# Altium project Newracom-WiWi.PrjPcb (part 1 of 3)
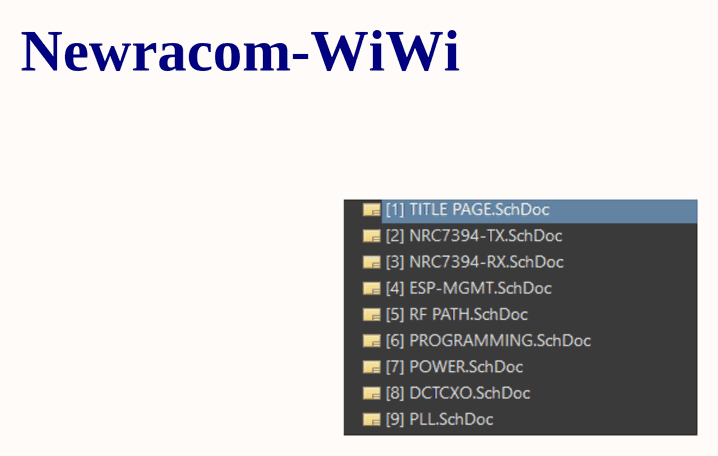
[diagram p0: TITLE PAGE.SchDoc]
DrawnBy: Armando Pinales; Revision: V1.1
8 sheets, 327 parts. Net scope: global (net labels, ports and power ports of the same name join across sheets).
Board file: Newracom_WIWi_V1.PcbDoc
Sheets:
  TITLE PAGE.SchDoc
  NRC7394-TX.SchDoc
  NRC7394-RX.SchDoc
  RF PATH.SchDoc
  PROGRAMMING.SchDoc
  POWER.SchDoc
  DCTCXO.SchDoc
  PLL.SchDoc

## Sheet TITLE PAGE.SchDoc: TITLE PAGE
size A; SheetNumber: 1; SheetTotal: 9

### Notes on the sheet
- Newracom-WiWi

## Sheet NRC7394-TX.SchDoc: ESP-TX
size C; SheetNumber: 2; SheetTotal: 9; SPICEModelCacheZYIMXMCN: <root> / <DocumentId>ZYIMXMCN</DocumentId> / </root>
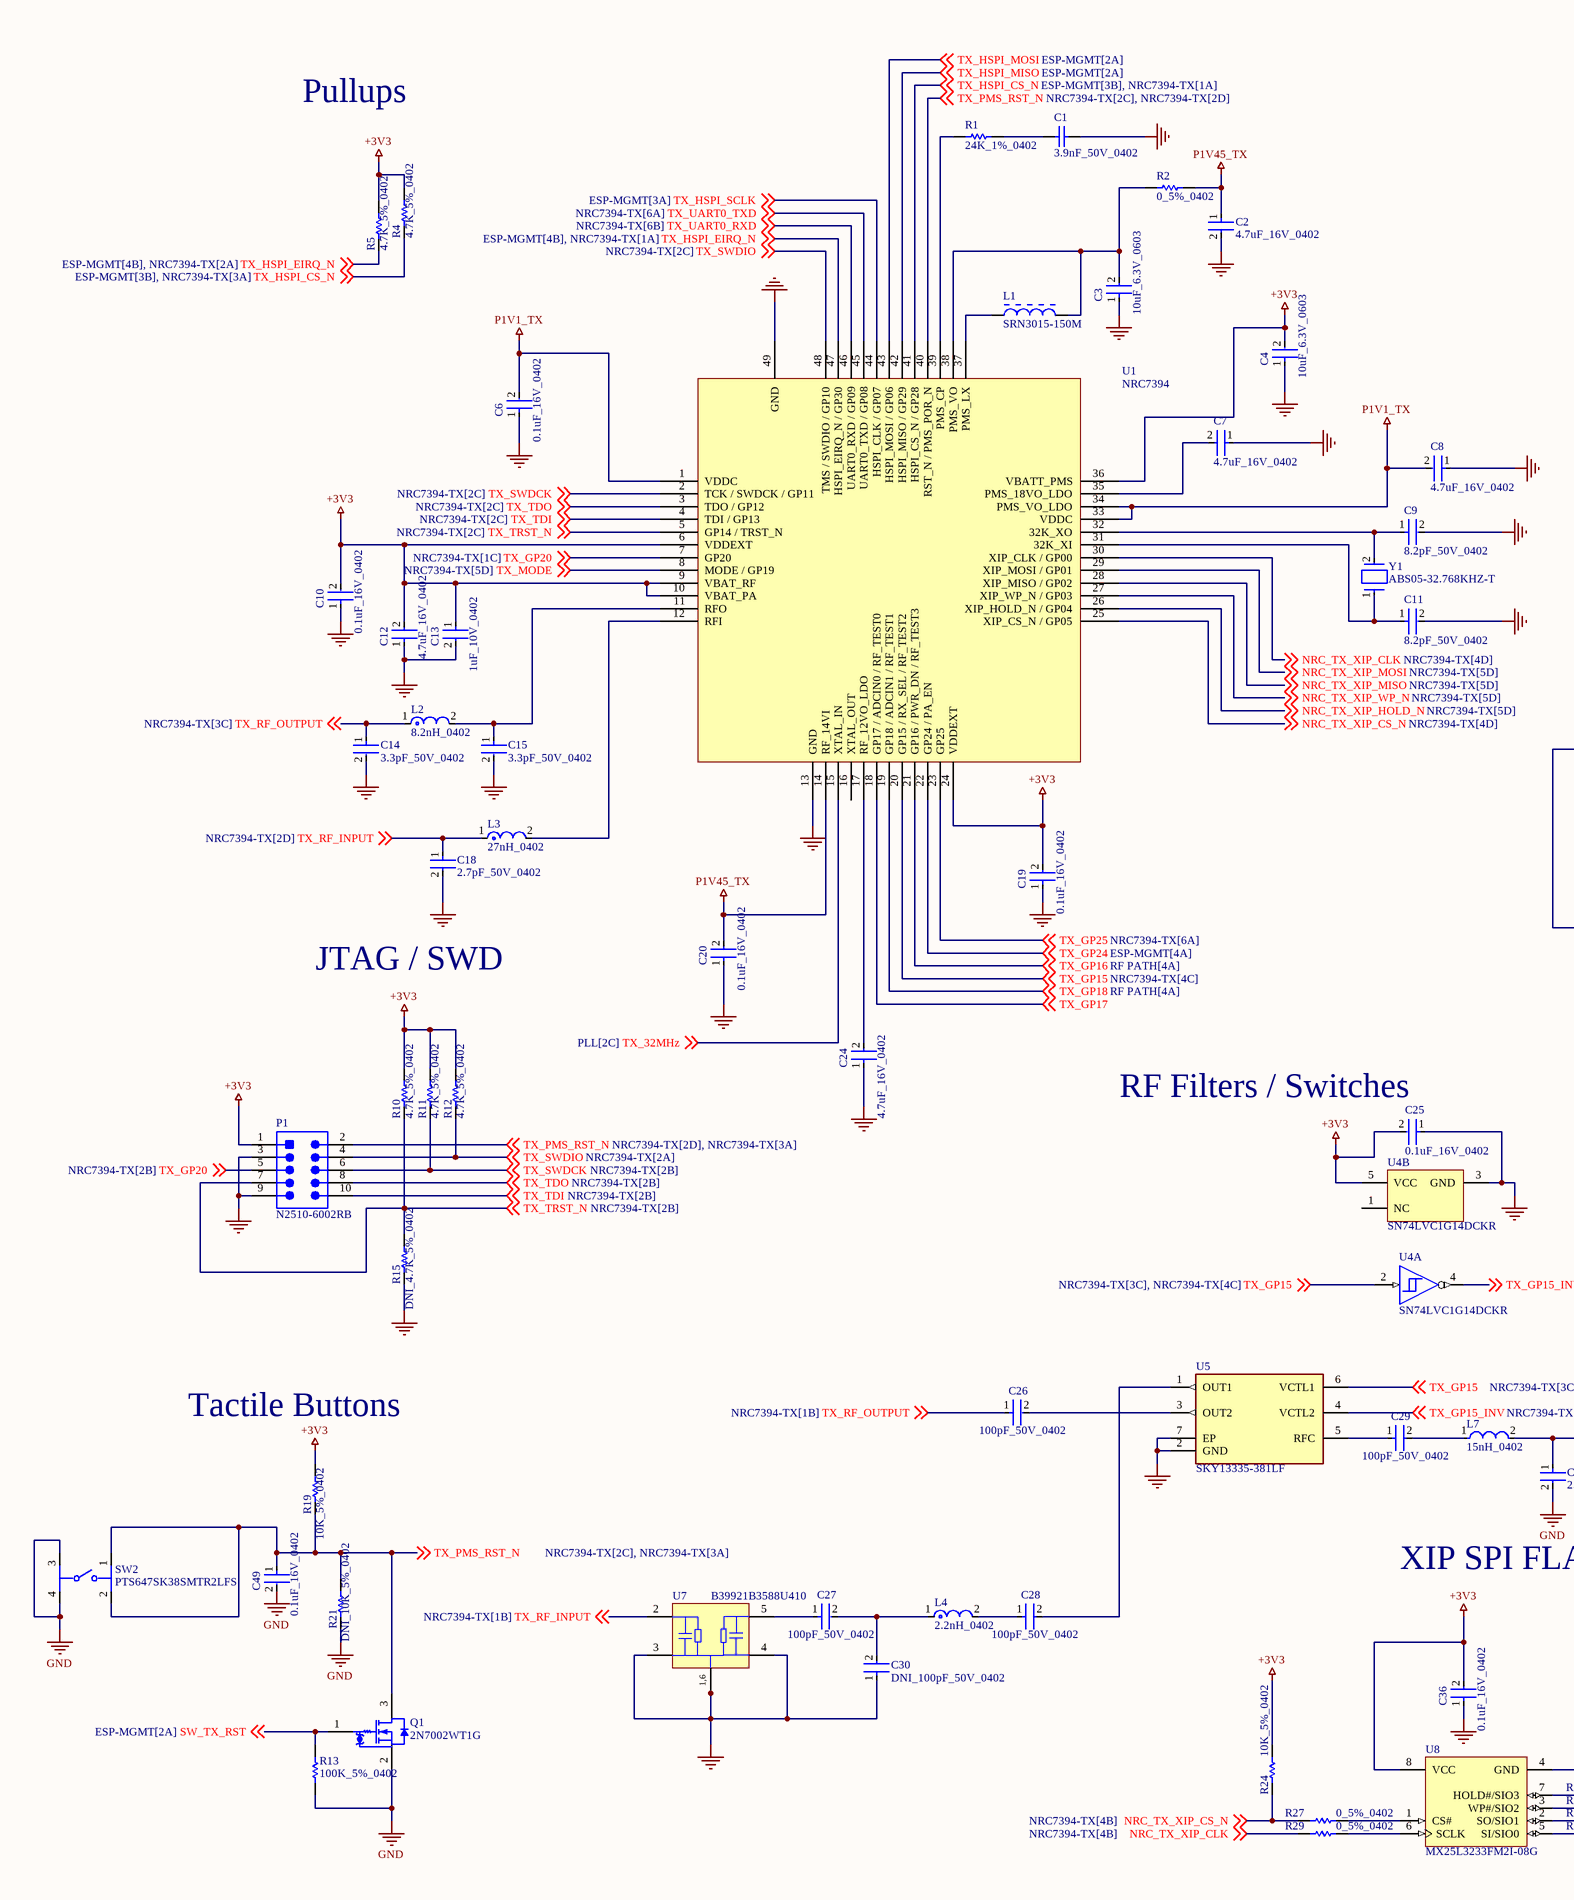
[diagram p1: NRC7394-TX.SchDoc, left]
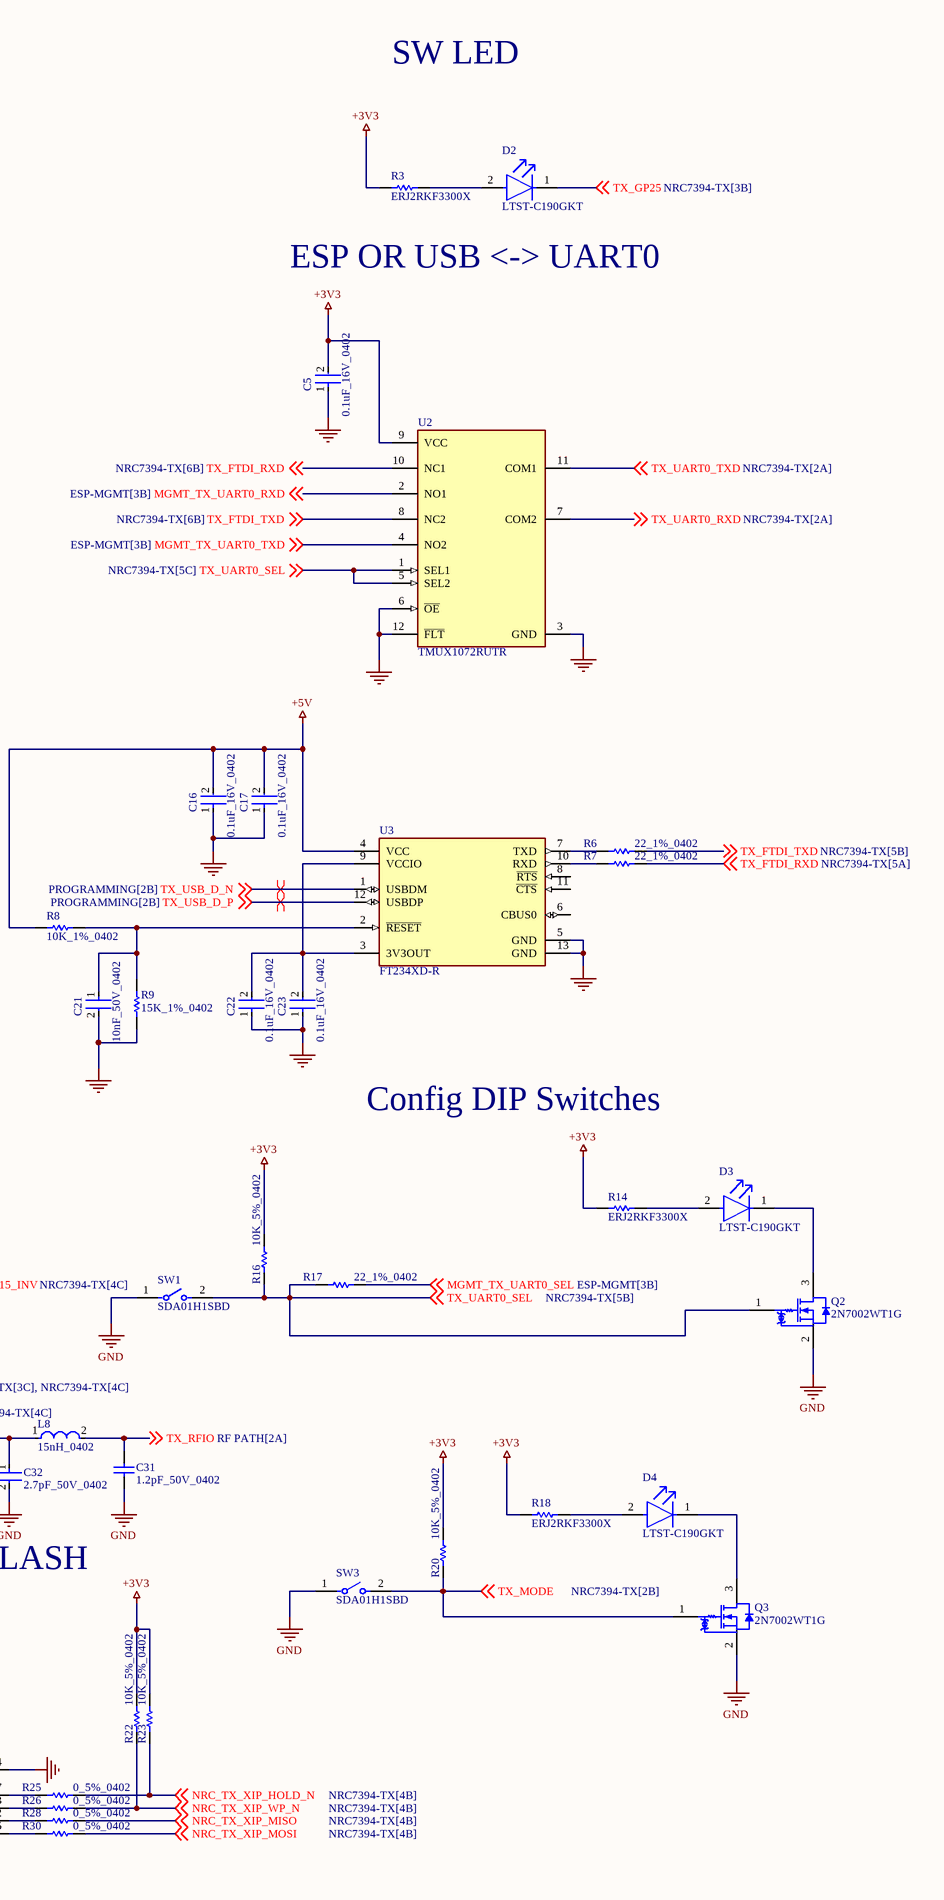
[diagram p2: NRC7394-TX.SchDoc, right]

### Parts
C1  3.9nF_50V_0402  [CAPC1005X56X25LL10T15]
C2  4.7uF_16V_0402  [FP-CL829-IPC_C]
C3  10uF_6.3V_0603  [FP-GRM188-0_1-e0_2_0_55-IPC_A]
C4  10uF_6.3V_0603  [FP-GRM188-0_1-e0_2_0_55-IPC_A]
C5  0.1uF_16V_0402  [FP-C0402-BB-MFG]
C6  0.1uF_16V_0402  [FP-C0402-BB-MFG]
C7  4.7uF_16V_0402  [FP-CL829-IPC_C]
C8  4.7uF_16V_0402  [FP-CL829-IPC_C]
C9  8.2pF_50V_0402  [FP-C0402-BB-MFG]
C10  0.1uF_16V_0402  [FP-C0402-BB-MFG]
C11  8.2pF_50V_0402  [FP-C0402-BB-MFG]
C12  4.7uF_16V_0402  [FP-CL829-IPC_C]
C13  1uF_10V_0402  [FP-C0402C105K8PACTU-MFG]
C14  3.3pF_50V_0402  [FP-C0402-BB-MFG]
C15  3.3pF_50V_0402  [FP-C0402-BB-MFG]
C16  0.1uF_16V_0402  [FP-C0402-BB-MFG]
C17  0.1uF_16V_0402  [FP-C0402-BB-MFG]
C18  2.7pF_50V_0402  [FP-GJM155-0_05-IPC_A]
C19  0.1uF_16V_0402  [FP-C0402-BB-MFG]
C20  0.1uF_16V_0402  [FP-C0402-BB-MFG]
C21  10nF_50V_0402  [FP-CL165-IPC_C]
C22  0.1uF_16V_0402  [FP-C0402-BB-MFG]
C23  0.1uF_16V_0402  [FP-C0402-BB-MFG]
C24  4.7uF_16V_0402  [FP-CL829-IPC_C]
C25  0.1uF_16V_0402  [FP-C0402-BB-MFG]
C26  100pF_50V_0402  [FP-C0402-BB-MFG]
C27  100pF_50V_0402  [FP-C0402-BB-MFG]
C28  100pF_50V_0402  [FP-C0402-BB-MFG]
C29  100pF_50V_0402  [FP-C0402-BB-MFG]
C30  DNI_100pF_50V_0402  [FP-C0402-BB-MFG]  (no BOM)
C31  1.2pF_50V_0402  [CAPC1006X50X20LL10T10]
C32  2.7pF_50V_0402  [FP-GJM155-0_05-IPC_A]
C36  0.1uF_16V_0402  [FP-C0402-BB-MFG]
C49  0.1uF_16V_0402  [FP-C0402-BB-MFG]
D2  LTST-C190GKT  [FP-LTST-C190GKT-MFG]
D3  LTST-C190GKT  [FP-LTST-C190GKT-MFG]
D4  LTST-C190GKT  [FP-LTST-C190GKT-MFG]
L1  SRN3015-150M  [BOUR-SRN3015-2_V]
L2  8.2nH_0402  [FP-LQG15HH_02-IPC_B]
L3  27nH_0402  [FP-LQG15HH_02-IPC_C]
L4  2.2nH_0402  [FP-LQG15HH_02-IPC_C]
L7  15nH_0402  [FP-HK1005-MFG]
L8  15nH_0402  [FP-HK1005-MFG]
P1  N2510-6002RB  [3M-N2510-6002-10_V]
Q1  2N7002WT1G  [ONSC-SC-70-3-419-04_V]
Q2  2N7002WT1G  [ONSC-SC-70-3-419-04_V]
Q3  2N7002WT1G  [ONSC-SC-70-3-419-04_V]
R1  24K_1%_0402  [RESC1005X40X25ML05T05]
R2  0_5%_0402  [RESC1005X40X25ML05T10]
R3  ERJ2RKF3300X  [RESC1005X40X25ML05T05]
R4  4.7K_5%_0402  [RESC1005X40X25LL05T05]
R5  4.7K_5%_0402  [RESC1005X40X25LL05T05]
R6  22_1%_0402  [RESC1005X40X25LL05T10]
R7  22_1%_0402  [RESC1005X40X25LL05T10]
R8  10K_1%_0402  [RESC1005X40X25NL05T10]
R9  15K_1%_0402  [RESC1005X40X25ML05T10]
R10  4.7K_5%_0402  [RESC1005X40X25LL05T05]
R11  4.7K_5%_0402  [RESC1005X40X25LL05T05]
R12  4.7K_5%_0402  [RESC1005X40X25LL05T05]
R13  100K_5%_0402  [RESC1005X37X25ML05T10]
R14  ERJ2RKF3300X  [RESC1005X40X25ML05T05]
R15  DNI_4.7K_5%_0402  [RESC1005X40X25LL05T05]  (no BOM)
R16  10K_5%_0402  [RESC1005X40X25ML05T05]
R17  22_1%_0402  [RESC1005X40X25LL05T10]
R18  ERJ2RKF3300X  [RESC1005X40X25ML05T05]
R19  10K_5%_0402  [RESC1005X40X25ML05T05]
R20  10K_5%_0402  [RESC1005X40X25ML05T05]
R21  DNI_10K_5%_0402  [RESC1005X40X25ML05T05]  (no BOM)
R22  10K_5%_0402  [RESC1005X40X25ML05T05]
R23  10K_5%_0402  [RESC1005X40X25ML05T05]
R24  10K_5%_0402  [RESC1005X40X25ML05T05]
R25  0_5%_0402  [RESC1005X40X25ML05T10]
R26  0_5%_0402  [RESC1005X40X25ML05T10]
R27  0_5%_0402  [RESC1005X40X25ML05T10]
R28  0_5%_0402  [RESC1005X40X25ML05T10]
R29  0_5%_0402  [RESC1005X40X25ML05T10]
R30  0_5%_0402  [RESC1005X40X25ML05T10]
SW1  SDA01H1SBD  [FP-SDA01H1SBD-MFG]
SW2  PTS647SK38SMTR2LFS  [FP-PTS647SK38SMTR2LFS-MFG]
SW3  SDA01H1SBD  [FP-SDA01H1SBD-MFG]
U1  NRC7394  [QFN48_6X6]
U2  TMUX1072RUTR  [FP-RUT0012A-MFG]
U3  FT234XD-R  [FP-DFN-12-IPC_B]
U4  SN74LVC1G14DCKR  [DCK0005A_L]  (parts A,B of 2)
U5  SKY13335-381LF  [FP-SKY13335-381LF-MFG]
U7  B39921B3588U410  [EPCO-DCC6C-6]
U8  MX25L3233FM2I-08G  [MXIC-SOP-8_M]
Y1  ABS05-32.768KHZ-T  [FP-ABS05-MFG]

### Nets
+3V3: C4.2 C5.2 C10.2 C12.2 C13.1 C19.2 C25.2 C36.2 P1.1 R3.1 R4.2 R5.2 R10.2 R11.2 R12.2 R14.1 R16.2 R18.1 R19.2 R20.2 R22.2 R23.2 R24.2 U1.6(VDDEXT) U1.9(VBAT_RF) U1.10(VBAT_PA) U1.24(VDDEXT) U1.36(VBATT_PMS) U2.9(VCC) U4.5(VCC) U8.8(VCC)
+5V: C16.2 C17.2 R8.1 U3.4(VCC)
GND: C1.2 C2.2 C3.1 C4.1 C5.1 C6.1 C7.1 C8.1 C9.2 C10.1 C11.2 C12.1 C13.2 C14.2 C15.2 C16.1 C17.1 C18.2 C19.1 C20.1 C21.2 C22.1 C23.1 C24.1 C25.1 C30.1 C31.1 C32.2 C36.1 C49.2 P1.3 P1.9 Q1.2(S) Q2.2(S) Q3.2(S) R9.1 R13.1 R15.1 R21.1 SW1.1 SW2.3 SW2.4 SW3.1 U1.13(GND) U1.49(GND) U2.3(GND) U2.6(~{OE}) U2.12(~{FLT}) U3.5(GND) U3.13(GND) U4.3(GND) U5.2(GND) U5.7(EP) U7.1(GND) U7.3(GND) U7.4(GND) U7.6(GND) U8.4(GND)
P1V1_TX: C6.2 C8.2 U1.1(VDDC) U1.33(VDDC) U1.34(PMS_VO_LDO)
P1V45_TX: C2.1 C20.2 R2.2 U1.14(RF_14VI)
MGMT_TX_UART0_RXD: U2.2(NO1) ; off-sheet MGMT_TX_UART0_RXD
MGMT_TX_UART0_SEL: R17.2 ; off-sheet MGMT_TX_UART0_SEL
MGMT_TX_UART0_TXD: U2.4(NO2) ; off-sheet MGMT_TX_UART0_TXD
NRC_TX_XIP_CLK: R29.1 U1.30(XIP_CLK_/_GP00) ; off-sheet NRC_TX_XIP_CLK
NRC_TX_XIP_CS_N: R24.1 R27.1 U1.25(XIP_CS_N_/_GP05) ; off-sheet NRC_TX_XIP_CS_N
NRC_TX_XIP_HOLD_N: R23.1 R25.2 U1.26(XIP_HOLD_N_/_GP04) ; off-sheet NRC_TX_XIP_HOLD_N
NRC_TX_XIP_MISO: R28.2 U1.28(XIP_MISO_/_GP02) ; off-sheet NRC_TX_XIP_MISO
NRC_TX_XIP_MOSI: R30.2 U1.29(XIP_MOSI_/_GP01) ; off-sheet NRC_TX_XIP_MOSI
NRC_TX_XIP_WP_N: R22.1 R26.2 U1.27(XIP_WP_N_/_GP03) ; off-sheet NRC_TX_XIP_WP_N
SW_TX_RST: Q1.1(G) R13.2 ; off-sheet SW_TX_RST
TX_32MHz: U1.15(XTAL_IN) ; off-sheet TX_32MHz
TX_FTDI_RXD: R7.2 U2.10(NC1) ; off-sheet TX_FTDI_RXD
TX_FTDI_TXD: R6.2 U2.8(NC2) ; off-sheet TX_FTDI_TXD
TX_GP15: U1.20(GP15_/_RX_SEL_/_RF_TEST2) U4.2(A) U5.6(VCTL1) ; off-sheet TX_GP15
TX_GP15_INV: U4.4(Y) U5.4(VCTL2) ; off-sheet TX_GP15_INV
TX_GP16: U1.21(GP16_/_PWR_DN_/_RF_TEST3) ; off-sheet TX_GP16
TX_GP17: U1.18(GP17_/_ADCIN0_/_RF_TEST0) ; off-sheet TX_GP17
TX_GP18: U1.19(GP18_/_ADCIN1_/_RF_TEST1) ; off-sheet TX_GP18
TX_GP20: P1.5 U1.7(GP20) ; off-sheet TX_GP20
TX_GP24: U1.22(GP24_/_PA_EN) ; off-sheet TX_GP24
TX_GP25: D2.1(C) U1.23(GP25) ; off-sheet TX_GP25
TX_HSPI_CS_N: R4.1 U1.41(HSPI_CS_N_/_GP28) ; off-sheet TX_HSPI_CS_N
TX_HSPI_EIRQ_N: R5.1 U1.47(HSPI_EIRQ_N_/_GP30) ; off-sheet TX_HSPI_EIRQ_N
TX_HSPI_MISO: U1.42(HSPI_MISO_/_GP29) ; off-sheet TX_HSPI_MISO
TX_HSPI_MOSI: U1.43(HSPI_MOSI_/_GP06) ; off-sheet TX_HSPI_MOSI
TX_HSPI_SCLK: U1.44(HSPI_CLK_/_GP07) ; off-sheet TX_HSPI_SCLK
TX_MODE: Q3.1(G) R20.1 SW3.2 U1.8(MODE_/_GP19) ; off-sheet TX_MODE
TX_PMS_RST_N: C49.1 P1.2 Q1.3(D) R19.1 R21.2 SW2.1 SW2.2 U1.40(RST_N_/_PMS_POR_N) ; off-sheet TX_PMS_RST_N
TX_RF_INPUT: C18.1 L3.1 U7.2(INPUT) ; off-sheet TX_RF_INPUT
TX_RF_OUTPUT: C14.1 C26.1 L2.1 ; off-sheet TX_RF_OUTPUT
TX_RFIO: C31.2 L8.2 ; off-sheet TX_RFIO
TX_SWDCK: P1.6 R11.1 U1.2(TCK_/_SWDCK_/_GP11) ; off-sheet TX_SWDCK
TX_SWDIO: P1.4 R12.1 U1.48(TMS_/_SWDIO_/_GP10) ; off-sheet TX_SWDIO
TX_TDI: P1.10 U1.4(TDI_/_GP13) ; off-sheet TX_TDI
TX_TDO: P1.8 U1.3(TDO_/_GP12) ; off-sheet TX_TDO
TX_TRST_N: P1.7 R10.1 R15.2 U1.5(GP14_/_TRST_N) ; off-sheet TX_TRST_N
TX_UART0_RXD: U1.46(UART0_RXD_/_GP09) U2.7(COM2) ; off-sheet TX_UART0_RXD
TX_UART0_SEL: Q2.1(G) R16.1 R17.1 SW1.2 U2.1(SEL1) U2.5(SEL2) ; off-sheet TX_UART0_SEL
TX_UART0_TXD: U1.45(UART0_TXD_/_GP08) U2.11(COM1) ; off-sheet TX_UART0_TXD
TX_USB_D_N: U3.1(USBDM) ; off-sheet TX_USB_D_N
TX_USB_D_P: U3.12(USBDP) ; off-sheet TX_USB_D_P
NetC1_1: C1.1 R1.2
NetC3_2: C3.2 L1.2 R2.1 U1.38(PMS_VO)
NetC7_2: C7.2 U1.35(PMS_18VO_LDO)
NetC9_1: C9.1 U1.32(32K_XO) Y1.2
NetC11_1: C11.1 U1.31(32K_XI) Y1.1
NetC15_1: C15.1 L2.2 U1.11(RFO)
NetC21_1: C21.1 R8.2 R9.2 U3.2(~{RESET})
NetC22_2: C22.2 C23.2 U3.3(3V3OUT) U3.9(VCCIO)
NetC24_2: C24.2 U1.17(RF_12VO_LDO)
NetC26_2: C26.2 U5.3(OUT2)
NetC27_1: C27.1 U7.5(OUTPUT)
NetC27_2: C27.2 C30.2 L4.1
NetC28_1: C28.1 L4.2
NetC28_2: C28.2 U5.1(OUT1)
NetC29_1: C29.1 U5.5(RFC)
NetC29_2: C29.2 L7.1
NetC32_1: C32.1 L7.2 L8.1
NetD2_2: D2.2(A) R3.2
NetD3_1: D3.1(C) Q2.3(D)
NetD3_2: D3.2(A) R14.2
NetD4_1: D4.1(C) Q3.3(D)
NetD4_2: D4.2(A) R18.2
NetL1_1: L1.1 U1.37(PMS_LX)
NetL3_2: L3.2 U1.12(RFI)
NetR1_1: R1.1 U1.39(PMS_CP)
NetR6_1: R6.1 U3.7(TXD)
NetR7_1: R7.1 U3.10(RXD)
NetR25_1: R25.1 U8.7(HOLD#/SIO3)
NetR26_1: R26.1 U8.3(WP#/SIO2)
NetR27_2: R27.2 U8.1(CS#)
NetR28_1: R28.1 U8.2(SO/SIO1)
NetR29_2: R29.2 U8.6(SCLK)
NetR30_1: R30.1 U8.5(SI/SIO0)

Not connected (* = marked no-connect by the designer): U1 16(XTAL_OUT); U3 6(CBUS0) 8(~{RTS}) 11(~{CTS}); U4 1(NC)

### Layout directives
differential pair: TX_USB_D_N, TX_USB_D_P

### Notes on the sheet
- SW LED
- Pullups
- ESP OR USB <-> UART0
- JTAG / SWD
- (near C25) RF Filters / Switches
- Config DIP Switches
- Tactile Buttons
- XIP SPI FLASH
- (in symbol CMP-2000-05901-1) 1,6

### Library data of the parts
C1 = CMP-2008-02725-1: Manufacturer: AVX Interconnect / Elco; Part Number: 04025C392JAT2A
C2 C7 C8 C12 C24 = CMP-13271-001468-1: Cap Ceramic 4.7uF 16V X5R ±20% SMD 0402 +85°C Paper T/R; Mount: Surface Mount; Case Code (Metric): 1005; Case/Package: 0402; Length: 0.039inch; Capacitance: 4.7uF; Voltage Rating: 16V; Max Operating Temperature: 85°C; Tolerance: 20%; Thickness: 0.022inch; Min Operating Temperature: -55°C; Case Code (Imperial): 0402; Packaging: Tape and Reel; Width: 0.02inch
C3 C4 = CMP-2006-02792-2: Chip Multilayer Ceramic Capacitors for General Purpose, 0603, 10uF, X5R, 15%, 20%, 6.3V; Packaging: Tape and Reel; Voltage Rating (DC): 6.3V; Width: 0.031inch; Termination: SMD/SMT; Dielectric: X5R; Package Quantity: 4000; Voltage Rating: 6.3V; Capacitance: 10uF; Case/Package: 0603; Min Operating Temperature: -55°C; Voltage: 6.3V; Length: 1.6mm; Thickness: 0.035inch; Lead Free: Lead Free; Depth: 0.8mm; Case Code (Imperial): 0603; Max Operating Temperature: 85°C; Material: Ceramic; Height: 0.8mm; Tolerance: 20%; Mount: Surface Mount; REACH SVHC: No SVHC; Radiation Hardening: No; Case Code (Metric): 1608
C5 C6 C10 C16 C17 C19 C20 C22 C23 C25 C36 C49 = CMP-2008-02094-2: CAP CER 0.1UF 16V 20% X7R 0402; Manufacturer: Kemet; Manufacturer Part Number: C0402C104M4RACTU; Temperature Coefficient: 15%; Material: Ceramic; Capacitance: 0.10 μF; Tolerance: 0.2; Value: 0.10 μF; Temperature Range High: +125°C; Device Class L3: Ceramic Capacitors; Category: Cap; RoHS: TRUE; ComponentLink2URL: https://content.kemet.com/datasheets/KEM_C1002_X7R_SMD.pdf; Temperature: -55°C to +125°C; Octopart: https://octopart.com/c0402c104m4ractu-kemet-10476575; Automotive: No; Height: 0.55mm; ComponentLink2Description: Datasheet; Device Class L2: Capacitors; Voltage Rating: 16 V; Device Class L1: Passive Components; Temperature Characteristic: X7R; Lead Free: Yes; Digikey Description: CAP CER 0.1UF 16V 20% X7R 0402; Mouser Description: Multilayer Ceramic Capacitors MLCC - SMD/SMT 16volts 0.1uF X7R 20%; Temperature Range Low: -55°C; Ipc Land Pattern Name: CAPC10050X50; Package: C0402-BB
C9 C11 = CMP-1034-00608-3: CAP CER 8.2PF 50V NP0 0402; Manufacturer Part Number: C0402C829C5GACTU; Manufacturer: Kemet; Tolerance: 0.25 pF; Temperature Coefficient: 15%; Temperature Characteristic: C0G; Material: Ceramic; Temperature Range Low: -55°C; Height: 0.55mm; ComponentLink2URL: https://content.kemet.com/datasheets/KEM_C1002_X7R_SMD.pdf; Ipc Land Pattern Name: CAPC10050X50; Temperature: -55°C to +125°C; Lead Free: Yes; RoHS: TRUE; Category: Cap; ComponentLink2Description: Datasheet; Voltage Rating: 50 V; Package: C0402-BB; Capacitance: 8.2 pF; Digikey Description: CAP CER 8.2PF 50V NP0 0402; Device Class L3: Ceramic Capacitors; Mouser Description: Multilayer Ceramic Capacitors MLCC - SMD/SMT 50volts 8.2pF C0G .25pF; Device Class L2: Capacitors; Octopart: https://octopart.com/c0402c829c5gactu-kemet-9144065; Temperature Range High: +125°C; Automotive: No; Device Class L1: Passive Components; Value: 8.2 pF
C13 = CMP-2008-02081-2: CAP CER 1UF 10V X5R 0402; Dielectric Material: Ceramic; Dissipation Factor: 5%; Tolerance: 10%; Number of Pins: 2; Contact Plating: Tin; Min Operating Temperature: -55°C; Termination: SMD/SMT; Lead Free: Lead Free; Construction: Flat; Voltage Rating (DC): 10V; Mount: Surface Mount; Series: C; Thickness: 0.022inch; Width: 0.5mm; Radiation Hardening: No; Capacitance: 1uF; Dielectric: X5R; Height: 0.5mm; Voltage: 10V; Length: 1mm; Depth: 0.5mm; Max Operating Temperature: 85°C; Package Quantity: 1; Packaging: Tape and Reel; RoHS Compliant: Yes; Case Code (Imperial): 0402; Case Code (Metric): 1005; REACH SVHC: No SVHC; Voltage Rating: 10V; Case/Package: 0402
C14 C15 = CMP-2008-03312-2: Capacitor: ceramic; MLCC; 3.3pF; 50VDC; C0G; ±0.25pF; SMD; 0402; Manufacturer Part Number: C0402C339C5GACTU; Manufacturer: Kemet; Temperature Coefficient: 15%; Voltage Rating: 50 V; RoHS: TRUE; Material: Ceramic; Capacitance: 3.3 pF; Value: 3.3 pF; Height: 0.55mm; Temperature: -55°C to +125°C; Package: C0402-BB; Mouser Description: Multilayer Ceramic Capacitors MLCC - SMD/SMT 50volts 3.3pF C0G .25pF; Category: Cap; ComponentLink2Description: Datasheet; Device Class L1: Passive Components; Tolerance: 0.25 pF; Temperature Characteristic: C0G; ComponentLink2URL: https://content.kemet.com/datasheets/KEM_C1002_X7R_SMD.pdf; Device Class L2: Capacitors; Temperature Range High: +125°C; Digikey Description: Capacitor: ceramic; MLCC; 3.3pF; 50VDC; C0G; ±0.25pF; SMD; 0402; Lead Free: Yes; Ipc Land Pattern Name: CAPC10050X50; Octopart: https://octopart.com/c0402c339c5gactu-kemet-105751; Automotive: No; Device Class L3: Ceramic Capacitors; Temperature Range Low: -55°C
C18 C32 = CMP-2008-03840-2: Multi-Layer Ceramic Capacitor 2.7pF C0G  ±0.1pF 0402 Paper T/R; Voltage Rating (DC): 50V; Temperature Coefficient: 30ppm/°C; Max Operating Temperature: 125°C; Lead Free: Lead Free; REACH SVHC: No SVHC; Thickness: 0.022inch; Length: 1mm; Height: 0.5mm; Min Operating Temperature: -55°C; Mount: Surface Mount; Case/Package: 0402; Case Code (Imperial): 0402; Width: 0.02inch; Capacitance: 2.7pF; Packaging: Tape and Reel; Package Quantity: 10000; Lead Pitch: 0.3mm; Dielectric: C0G; Depth: 0.5mm; Voltage Rating: 50V; Radiation Hardening: No; Termination: SMD/SMT; Voltage: 50V; Number of Pins: 2; Case Code (Metric): 1005
C21 = CMP-13271-000387-1: Cap Ceramic 10nF 50V X7R ±10% SMD 0402 +125°C Paper T/R; Depth: 0.5mm; Length: 1mm; Lead Free: Lead Free; Case Code (Metric): 1005; Width: 0.02inch; Min Operating Temperature: -55°C; Thickness: 0.022inch; Package Quantity: 1; Mount: Surface Mount; Height: 0.5mm; Voltage: 50V; Material: Ceramic; Tolerance: 10%; Case Code (Imperial): 0402; Radiation Hardening: No; Case/Package: 0402; Max Operating Temperature: 125°C; Voltage Rating (DC): 50V; Contact Plating: Tin; Packaging: Tape and Reel; Voltage Rating: 50V; Capacitance: 10nF; Dielectric: X7R
C26-C30 = CMP-2008-03284-2: CAP CER 100PF 50V C0G/NP0 0402; Manufacturer: Kemet; Manufacturer Part Number: C0402C101J5GACTU; Tolerance: 0.05; Temperature Characteristic: C0G; Temperature Coefficient: 15%; Material: Ceramic; Digikey Description: CAP CER 100PF 50V C0G/NP0 0402; Lead Free: Yes; Capacitance: 100 pF; Device Class L3: Ceramic Capacitors; Mouser Description: Multilayer Ceramic Capacitors MLCC - SMD/SMT 50volts 100pF C0G 5%; Octopart: https://octopart.com/c0402c101j5gactu-kemet-132471; Temperature Range Low: -55°C; Value: 100 pF; Automotive: No; Height: 0.55mm; Category: Cap; ComponentLink2URL: https://content.kemet.com/datasheets/KEM_C1002_X7R_SMD.pdf; RoHS: TRUE; Ipc Land Pattern Name: CAPC10050X50; Temperature Range High: +125°C; Device Class L2: Capacitors; Package: C0402-BB; ComponentLink2Description: Datasheet; Temperature: -55°C to +125°C; Voltage Rating: 50 V; Device Class L1: Passive Components
C31 = CMP-2008-04752-1: Manufacturer: AVX Interconnect / Elco; Part Number: 04023J1R2BBSTR
D2-D4 = CMP-22017-000005-2: LED GREEN CLEAR CHIP SMD; Dominant Wavelength: 569nm; Reverse Voltage: 5V; Lens Color: Colorless; Viewing Angle: 130°; Voltage: 2V; Forward Current: 30mA; Power Dissipation: 100mW; Luminous Intensity: 6mcd; Number of LEDs: 1; Forward Voltage: 2.1V; Wavelength: 565nm; Test Current: 10mA; Min Operating Temperature: -55°C; Lens Style: Clear; Mount: Surface Mount; Width: 0.8mm; Packaging: Tape and Reel; Lens Transparency: Clear; Case Code (Metric): 1608; Depth: 0.8mm; Case Code (Imperial): 0603; Case/Package: 0603; Number of Pins: 2; Max Operating Temperature: 85°C; Lead Free: Lead Free; Number of Elements: 1; Length: 1.6mm; Height: 0.8mm; Package Quantity: 1; Power Rating: 100mW; Radiation Hardening: No; Illumination Color: Green; Color: Green
L1 = CMP-0007-00012-1: Semi-shielded Power Inductor, 15 uH, +/- 20%, 0.8 A, -40 to 125 degC, 3 x 3 x 1.5 mm SMD, RoHS and Halogen Free, Tape and Reel; Manufacturer: Bourns; Isat: 0.68 A; Resistance to Solder Heat: +260 degC for 10 sec.; Inductance tolerance: +/- 20%; Rated current: 0.8 A; DCR Max: 0.422 Ohm; SRF Min: 33 MHz; Inductance: 15 uH; ComponentLink3Description: Package Specification; ComponentLink2URL: http://www.bourns.com/data/global/pdfs/SRN3015.pdf; Mounting Technology: Surface Mount; Operating Temperature: -40 to 125 degC; PartNumber: SRN3015-150M; ComponentLink1URL: http://www.bourns.com/; PackageReference: SRN3015; ComponentLink1Description: Manufacturer URL; PackageDescription: 2-Pin SMD, Body 3 x 3 mm, Height 1.5 mm; Packing: Tape and Reel; RoHS: TRUE; ComponentLink2Description: Datasheet; DatasheetVersion: Aug-11; ComponentLink3URL: http://www.bourns.com/data/global/pdfs/SRN3015.pdf
L2 = CMP-06042-007420-1: Multilayer type RF Inductor 8.2nH ±5% 0.24Ω 550mA 0402; Current Rating: 300mA; Test Frequency: 100MHz; Shielding: Unshielded; Self Resonant Frequency: 3.7GHz; Core Material: Air; DC Resistance (DCR): 240mR; Q Factor: 8; Package Quantity: 10000; Lead Free: Lead Free; Case Code (Imperial): 0402; Width: 0.02inch; Height: 0.5mm; Inductance: 8.2nH; Height - Seated (Max): 0.022inch; Depth: 0.55mm; Termination: SMD/SMT; Packaging: Tape and Reel; DC Current: 300mA; Tolerance: 5%; Case/Package: 0402; Mount: Surface Mount; Max Operating Temperature: 125°C; Max DC Current: 300mA; Case Code (Metric): 1005; Radiation Hardening: No; Military Standard: Not; Length: 1mm; Weight: 2.3E-05oz; Min Operating Temperature: -55°C
L3 = CMP-2000-06578-2: Multilayer type RF Inductor 27nH ±5% 0.46Ω 350mA 0402; DC Current: 300mA; Core Material: Air; Self Resonant Frequency: 1.7GHz; Q Factor: 8; DC Resistance (DCR): 460mR; Shielding: Unshielded; Test Frequency: 100MHz; Inductance: 27nH; Width: 0.02inch; Length: 1mm; Height - Seated (Max): 0.022inch; Military Standard: Not; Case Code (Imperial): 0402; Tolerance: 5%; Depth: 0.55mm; Current Rating: 300mA; Inductance Tolerance: 5%; Lead Free: Lead Free; Height: 0.5mm; Max DC Current: 300mA; REACH SVHC: No SVHC; Package Quantity: 10000; Mount: Surface Mount; Termination: SMD/SMT; Case Code (Metric): 1005; Case/Package: 0402; Max Operating Temperature: 125°C; Packaging: Tape and Reel; Min Operating Temperature: -55°C
L4 = CMP-1662-00024-2: Multilayer type RF Inductor 2.2nH ±0.3nH 0.09Ω 900mA 0402; Test Frequency: 100MHz; Core Material: Air; DC Resistance (DCR): 150mR; Q Factor: 8; Shielding: Unshielded; Self Resonant Frequency: 6GHz; Current Rating: 300mA; Lead Free: Lead Free; Military Standard: Not; Case Code (Imperial): 0402; Case Code (Metric): 1005; Min Operating Temperature: -55°C; Width: 0.02inch; Depth: 0.55mm; Length: 1mm; REACH SVHC: No SVHC; Height - Seated (Max): 0.022inch; Case/Package: 0402; Inductance: 2.2nH; Height: 0.02inch; Package Quantity: 10000; Packaging: Tape and Reel; Mount: Surface Mount; Max DC Current: 300mA; Number of Pins: 2; Max Operating Temperature: 125°C; Termination: SMD/SMT; DC Current: 300mA; Radiation Hardening: No
L7 L8 = CMP-14484-000027-1: FIXED IND 15NH 320MA 460 MOHM; Self Resonant Frequency: 2.3GHz; DC Resistance (DCR): 460mR; Inductance Tolerance: 5%; Test Frequency: 100MHz; Shielding: Unshielded; Body Material: Ceramic; Core Material: Ferrite; Max DC Current: 300mA; Q Factor: 8; Case/Package: 0402; Radiation Hardening: No; Mount: Surface Mount; Military Standard: Not; Lead Free: Exempt; Length: 0.039inch; Min Operating Temperature: -55°C; Max Operating Temperature: 125°C; Package Quantity: 10000; Height - Seated (Max): 0.022inch; Inductance: 15nH; Case Code (Imperial): 0402; Depth: 0.55mm; Case Code (Metric): 1005; DC Current: 320mA; Width: 0.02inch; Termination: SMD/SMT; Halogen Free: Halogen Free; Current Rating: 320mA; Height: 0.5mm; Number of Pins: 2; Series: HK; Tolerance: 5%; Packaging: Tape and Reel; RoHS Compliant: Yes
P1 = CMP-2000-06794-1: Male Header, Pitch 2.54 mm, 2 x 5 Postion, Height 9.91 mm, Tail Length 2.84 mm, -55 to 105 degC, RoHS, Bulk; PartNumber: N2510; Manufacturer: 3M; Package Version: Rev. M, 08/2014; Rad Hard: No; No. of Rows: 2; Number of Contacts: 10; Pitch: 2.54mm; Termination Method: Solder; Manufacturer URL: http://www.3m.com/; Package Description: 10-Pin Through Hole Device, Body 20.02 x 8.59 mm, Pitch 2.54 mm; Gender: Male; Number of Rows: 2; Orientation: Straight; Contact Plating: GoldOverNickel; Packaging: Rail/Tube; Mounting Technology: ThroughHole; Datasheet URL: https://datasheet.ciiva.com/11746/0900766b807b18da-11746957.pdf; Package Reference: N2510-6002-10; Datasheet Version: 05/2007; No. of Positions: 10; Package URL: http://multimedia.3m.com/mws/media/330367O/3mtm-100-in-4-wall-hdr-rohs-lp-straightra-hitemp-ts0770.pdf; Type: ShroudedHeader
Q1-Q3 = CMP-1058-00618-1: Small Signal MOSFET, 60 V, 340 mA, Single, N-Channel, 3-Pin SC70, Pb-Free, Tape and Reel; Manufacturer: On Semiconductor; Crss Typ (pF): 2.2; Coss Typ (pF): 4.2; VGS(th) Max (V): 2.5; Channel Polarity: N Channel; ID Max (A): 0.34; VGS Max (V): 20; V(BR)DSS Min (V): 60; Ciss Typ (pF): 24.5; Configuration: Single; Packing: Tape and Reel; Package Type: SC-70-3 / SOT-323-3; RoHS: Pb-Free; ComponentLink3Description: Package Specification; PackageReference: SC-70-3-419-04; Mounting Technology: Surface Mount; PackageVersion: Rev. N, 11/2008; ComponentLink2URL: http://www.onsemi.com/pub_link/Collateral/2N7002W-D.PDF; PartNumber: 2N7002WT1G; ComponentLink2Description: Datasheet; ComponentLink3URL: http://www.onsemi.cn/pub_link/Collateral/419-04.PDF; ComponentLink1Description: Manufacturer URL; ComponentLink1URL: http://www.onsemi.com/; DatasheetVersion: Rev. 5; PackageDescription: 3-Pin Small Outline Transistor, Body 2 x 1.25 mm, Pitch 0.65 mm
R1 = CMP-2002-08403-1: Part Number: CRCW040224K0FKED; Manufacturer: Vishay Dale
R2 R25-R30 = CMP-2002-06457-1: Manufacturer: Panasonic; Part Number: ERJ-U020R00X
R3 R14 R18 = CMP-2002-01143-1: Manufacturer: Panasonic; Part Number: ERJ2RKF3300X
R4 R5 R10-R12 R15 = CMP-1011-00090-2: Part Number: CRCW04024K70JNTD; Manufacturer: Vishay Dale
R6 R7 R17 = CMP-2002-07520-1: Manufacturer: Yageo / Phycomp; Part Number: RC0402FR-0722RL
R8 = CMP-2002-06487-1: Manufacturer: Multicomp; Part Number: MCMR04X103 JTL
R9 = CMP-2002-08068-1: Manufacturer: Yageo; Part Number: RC0402JR-1315KL
R13 = CMP-2002-01850-1: Part Number: RE0402DR-07100KL; Manufacturer: Yageo / Phycomp
R16 R19-R24 = CMP-2002-01181-1: Manufacturer: Panasonic; Part Number: ERT-J0EM103J
SW1 SW3 = CMP-10033-000001-1: SWITCH SLIDE DIP SPST 25MA 24V; Manufacturer: C&K Components; Electromechanical Life: 1000Cycles; Contact Resistance: 50mΩ; Standoff Height: 0.037inch; Number Of Circuits: 1; Throw Configuration: SPST; Temperature Range High: +85°C; ComponentLink2Description: Datasheet; Manufacturer Part Number: SDA01H1SBD; Contact Current Rating: 25mA; Mouser Description: DIP Switches / SIP Switches 1 Pos SPST SMT SDA Series DIP SW; Digikey Description: SWITCH SLIDE DIP SPST 25MA 24V; RoHS: TRUE; Device Class L2: Switches; Octopart: https://octopart.com/sda01h1sbd-c%26k+components-7089741; Temperature: -40°C to +85°C; Automotive: No; Package: SDA01H1SBD; Height: 0.214inch; Device Class L1: Electromechanical; Category: Switch; Device Class L3: DIP Switches; Lead Free: Yes; Voltage Rating Dc: 24V; Temperature Range Low: -40°C; ComponentLink2URL: https://www.ckswitches.com/media/1327/sda.pdf
SW2 = CMP-10040-000033-1: TACT 4.5 X 4.5, 3.8 MM H, 2.5N,; Switch Function: Off-Mom; Switch Travel: 0.25mm; Actuator Type: Standard; Illumination Type: Non-Illuminated; Mechanical Life: 100000Cycles; Ratings: IP40; Operating Force: 250gf; Throw Configuration: SPST; Max Operating Temperature: 70°C; Min Operating Temperature: -20°C; Termination: Gull Wing; Mount: Surface Mount; Packaging: Tape and Reel
U1 = NRC7394: NRC7394 WiFi HaLow chipset
U2 = CMP-04892-000114-1: IC SWITCH SPDT DUAL 12UQFN; Number of Circuits: 2; -3db Bandwidth: 1.2GHz; On-State Resistance: 18R; Number of Pins: 12; Min Operating Temperature: -40°C; RoHS Compliant: Yes; Max Operating Temperature: 125°C; Number of Channels: 2; Packaging: Tape and Reel
U3 = CMP-0248-00027-3: IC USB SERIAL BASIC UART 12DFN; Min Supply Voltage: 2.97V; Number of Ports: 1; Operating Supply Voltage: 5V; Operating Supply Current: 8mA; Max Supply Voltage: 5.5V; Data Rate: 3Mbps; Length: 3mm; Case/Package: DFN; Mount: Surface Mount; Packaging: Tape and Reel; Max Operating Temperature: 85°C; Height: 0.75mm; Number of Pins: 12; Number of Transceivers: 1; Package Quantity: 5000; Min Operating Temperature: -40°C; Width: 3mm; REACH SVHC: No SVHC; Interface: UART; Lead Free: Lead Free
U4 = CMP-0859-00440-4: Single Schmitt-Trigger Inverter, DCK0005A, LARGE T&R; Manufacturer: Texas Instruments; Output Drive (IOL/IOH)(Max)(mA): 32/-32; Schmitt Trigger: Yes; Logic: Inverting; Bits(#): 1; Rating: Catalog; tpd @ Nom Voltage(Max)(ns): 11,6.5,5.5,5; Voltage(Nom)(V): 1.8,2.5,3.3,5; Output Type: CMOS; VCC(Min)(V): 1.65; ICC @ Nom Voltage(Max)(mA): 0.01; Input Type: CMOS/TTL; F @ Nom Voltage(Max)(Mhz): 150; VCC(Max)(V): 5.5; Sub-Family: Inverting Buffer/Driver; 3-State Output: No; Technology Family: LVC; PackageReference: DCK0005A; Operating Temperature Range(C): -40 to 125,-40 to 85; Generic Part Number: SN74LVC1G14; DatasheetVersion: SCES218W
U5 = CMP-85923-000005-1: IC RF SWITCH SPDT 6GHZ 6MLPD; Insertion Loss: 0.5dB; Turn-Off Delay Time: 50ns; P1dB: 26dBm; IIP3: 41dBm; Impedance: 50R; Number of Switches: 1; Operating Frequency: 100 MHz to 6 GHz; Throw Configuration: SPDT; Frequency: 6GHz; Number of Pins: 6; Turn-On Delay Time: 50ns; Package Quantity: 3000; Min Operating Temperature: -40°C; RoHS Compliant: Yes; Series: -; Radiation Hardening: No; Lead Free: Lead Free; Max Operating Temperature: 85°C; Packaging: Tape and Reel; Case/Package: QFN
U7 = CMP-2000-05901-1: SAW RF Filter, 915 MHz, -45 to 125 degC, 6-Pin SMD, RoHS, Tape and Reel; Manufacturer: EPCOS; No. of Pins: 6; SVHC: ToBeAdvised; Pass Band Frequency: 902MHzto928MHz; SAW Filter Applications: RemoteControlReceivers; Center Frequency: 915MHz; Mounting Technology: SurfaceMount; Datasheet Version: Rev. 2.3, 08/2008; Package Reference: DCC6C; Package Description: 6-Pin Surface Mount Device, Body 3 x 3 mm, Pitch 1.2 mm; Manufacturer URL: https://en.tdk.eu/; Datasheet URL: https://datasheet.ciiva.com/1127/1598293-1127012.pdf; Filter Case Style: SMD
U8 = CMP-2000-05278-1: CMOS MXSMIO(R) (Serial Multi I/O) Flash Memory, 32 Mbits (x1/x2/x4), 3 V, -40 to 85 degC, 8-Pin SOP; Manufacturer: Macronix; Manufacturer URL: http://www.macronix.com; Package Description: 8-Pin Small Outline Package, Body 5.23 x 5.28 mm, Pitch 1.27 mm; Datasheet URL: http://datasheet.octopart.com/MX25L3233FM2I-08G-Macronix-datasheet-38883555.pdf; Datasheet Version: Rev. 1.1, 01/2015; Package Reference: SOP-8
Y1 = CMP-27762-008890-2: Crystal 32.768kHz ±20ppm (Tol) 12.5pF FUND 90kΩ 2-Pin SMD T/R; Series Resistance: 90kR; Length: 1.6mm; Package Quantity: 3000; Packaging: Tape and Reel; Max Operating Temperature: 85°C; Lead Free: Lead Free; Tolerance: 20ppm; Frequency: 32.768kHz; Termination: SMD/SMT; REACH SVHC: No SVHC; Width: 1mm; Min Operating Temperature: -40°C; RoHS Compliant: Yes; Case/Package: CSMD; ESR (Equivalent Series Resistance): 90kR; Number of Pins: 2; Height: 0.5mm; Series: ABS05; Load Capacitance: 12.5pF; Frequency Tolerance: 20ppm; Depth: 1mm; Operating Frequency: 32.768 kHz; Mount: Surface Mount; Radiation Hardening: No